# EAGLE design cambot (EAGLE 5.11)
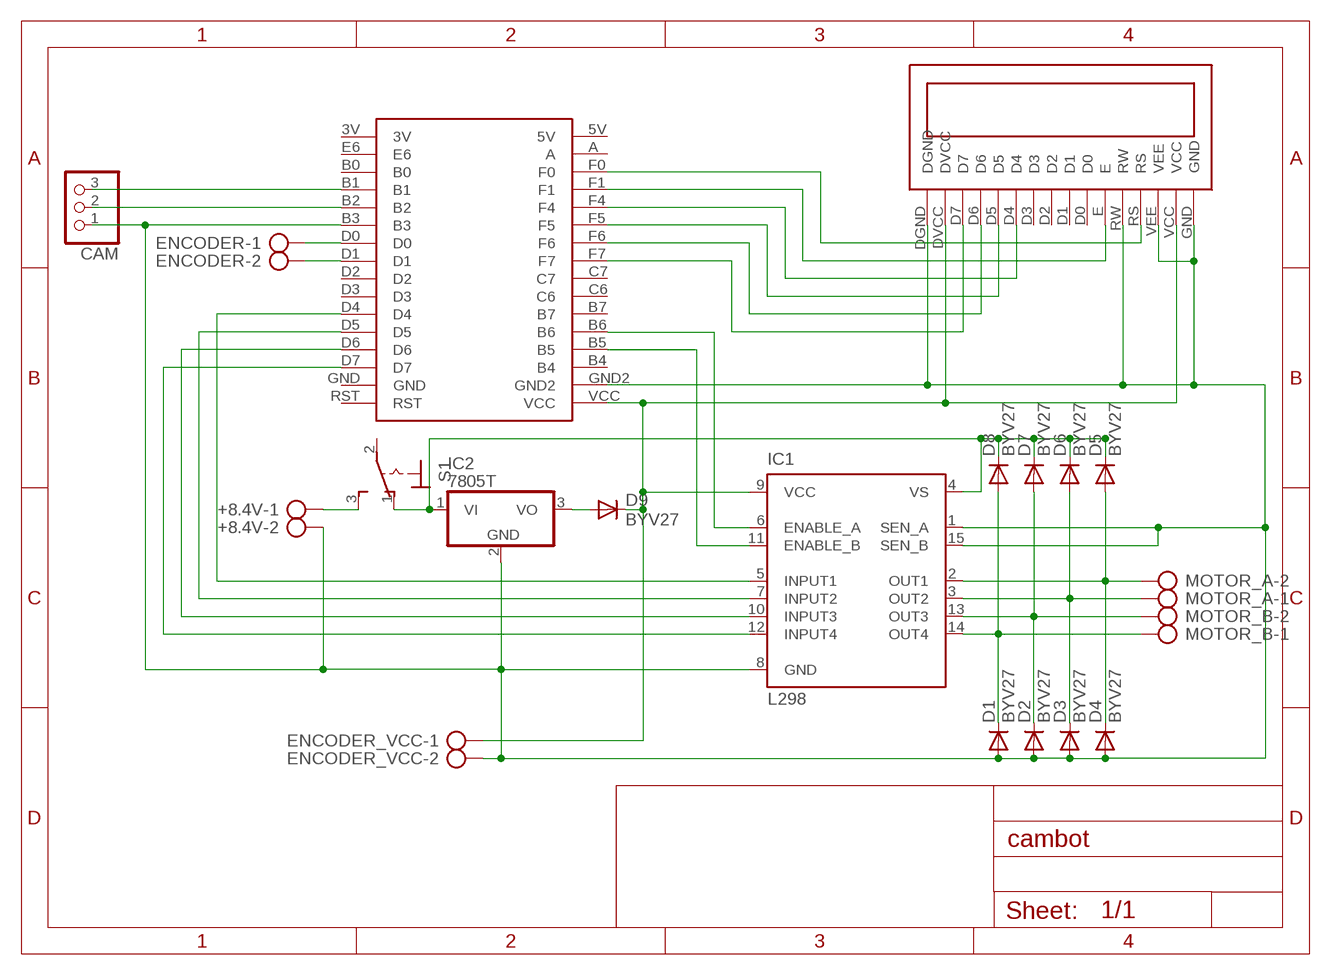
[diagram p0: schematic, sheet 1]

## Parts
+8.4V  AK500/2  [AK500/2]
CAM  PINHD-1X3  [1X03]
D1  BYV27  [SOD57-10]
D2  BYV27  [SOD57-10]
D3  BYV27  [SOD57-10]
D4  BYV27  [SOD57-10]
D5  BYV27  [SOD57-10]
D6  BYV27  [SOD57-10]
D7  BYV27  [SOD57-10]
D8  BYV27  [SOD57-10]
D9  BYV27  [SOD57-10]
ENCODER  AK500/2  [AK500/2]
ENCODER_VCC  AK500/2  [AK500/2]
IC1  L298  [MULTIWATT-15]
IC2  7805T  [TO220H]
MOTOR_A  AK500/2  [AK500/2]
MOTOR_B  AK500/2  [AK500/2]
S1  320-916  [320-916]
U$1  ATMEGA32U4BREAKOUTBOARD  [ATMEGA32U4BREAKOUT]
U$2  LCD16X2  [LCD2X16]

## Nets
N$1: D9.C ENCODER_VCC.1 IC1.9(VCC) U$1.VCC U$2.DVCC U$2.VCC
N$2: D5.C D6.C D7.C D8.C IC1.4(VS) IC2.1(VI) S1.1(O)
N$3: U$1.F0 U$2.RS
N$4: D4.C D5.A IC1.2(OUT1) MOTOR_A.2
N$5: D3.C D6.A IC1.3(OUT2) MOTOR_A.1
N$6: D2.C D7.A IC1.13(OUT3) MOTOR_B.2
N$7: D1.C D8.A IC1.14(OUT4) MOTOR_B.1
N$8: IC1.6(ENABLE_A) U$1.B6
N$9: IC1.11(ENABLE_B) U$1.B5
N$10: IC1.5(INPUT1) U$1.D4
N$11: IC1.7(INPUT2) U$1.D5
N$12: IC1.10(INPUT3) U$1.D6
N$13: IC1.12(INPUT4) U$1.D7
N$14: CAM.3 U$1.B1
N$15: CAM.2 U$1.B2
N$16: U$1.F1 U$2.E
N$17: ENCODER.1 U$1.D0
N$18: ENCODER.2 U$1.D1
N$19: +8.4V.2 CAM.1 D1.A D2.A D3.A D4.A ENCODER_VCC.2 IC1.1(SEN_A) IC1.8(GND) IC1.15(SEN_B) IC2.2(GND) U$1.B3 U$1.GND2 U$2.DGND U$2.GND U$2.RW U$2.VEE
N$20: U$1.F4 U$2.D4
N$21: U$1.F5 U$2.D5
N$22: U$1.F6 U$2.D6
N$23: U$1.F7 U$2.D7
N$24: D9.A IC2.3(VO)
N$25: +8.4V.1 S1.3(S)
Unconnected: S1.2(P) U$1.3V U$1.5V U$1.A U$1.B0 U$1.B4 U$1.B7 U$1.C6 U$1.C7 U$1.D2 U$1.D3 U$1.E6 U$1.GND U$1.RST U$2.D0 U$2.D1 U$2.D2 U$2.D3

## Library data of the parts
+8.4V ENCODER ENCODER_VCC MOTOR_A MOTOR_B = con-ptr500:AK500/2: CONNECTOR; OC_FARNELL: unknown; OC_NEWARK: unknown
CAM = pinhead:PINHD-1X3: PIN HEADER
D1-D9 = diode:BYV27: DIODE ultra fast
IC1 = st-microelectronics:L298: DUAL FULL-BRIDGE DRIVER; MPN: L298N; OC_FARNELL: 1589425; OC_NEWARK: 32M1527
IC2 = linear:78*: Positive VOLTAGE REGULATOR Source: http://cache.national.com/ds/LM/LM78L05.pdf http://www.fairchildsemi.com/ds/LM/LM7805.pdf
S1 = switch:320-916: TOGGLE SWITCH distributor RS Components
U$1 = atmega32u4breakout:ATMEGA32U4BREAKOUTBOARD
U$2 = lcd16x2:LCD16X2

## Board
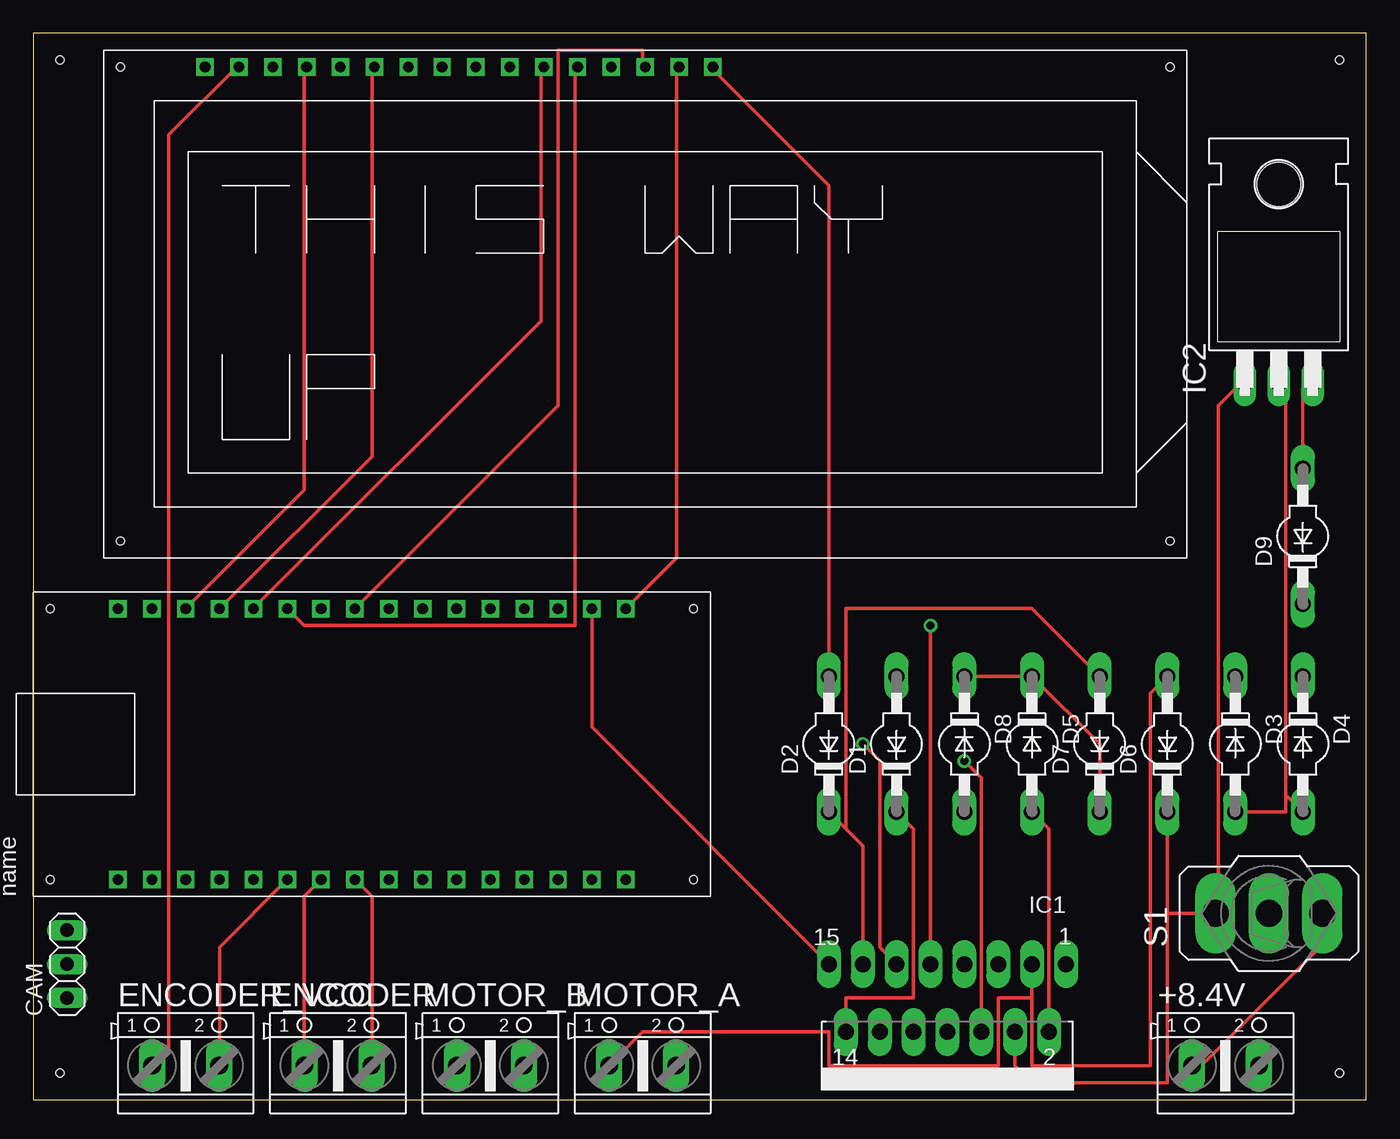
[diagram p1: board, top side]
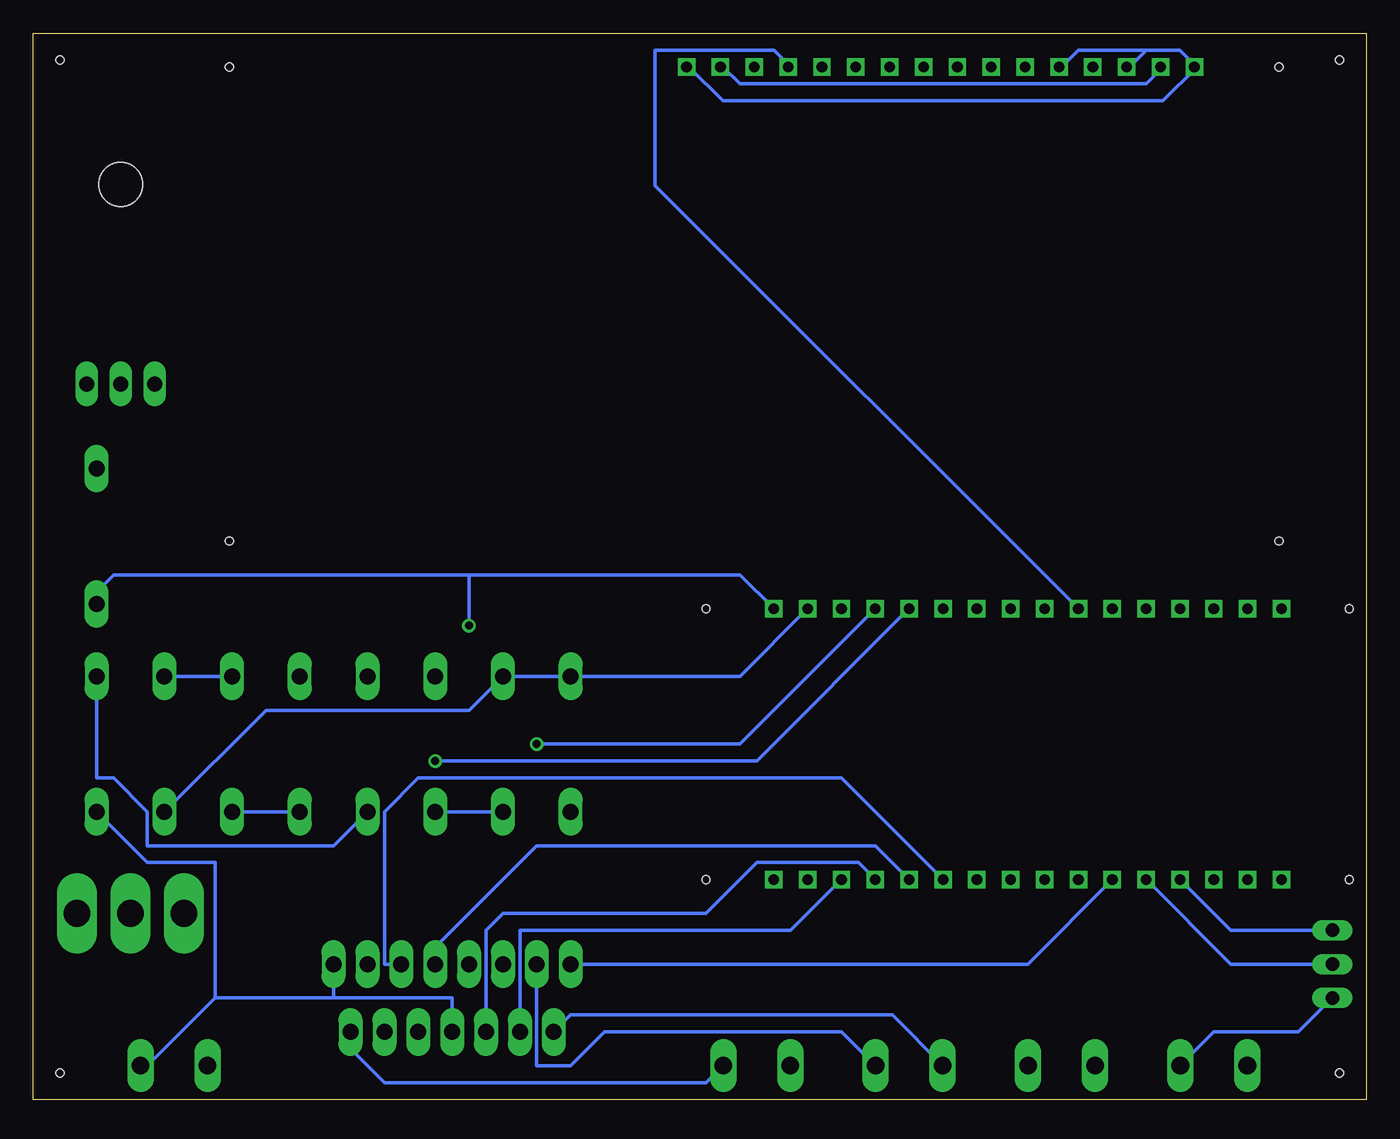
[diagram p2: board, bottom side, seen from below]

Size 100 x 80 mm. Coordinates in mm from the lower left corner, seen from the top.
Outline: 0,0 100,0 100,80 0,80 0,0
Copper layers (1*16): Top 0.035mm / dielectric 1.5mm / Bottom 0.035mm
Design rules "default": minimum track width 10mil, minimum drill 24mil, track to track 8mil, track to pad 8mil, pad to pad 8mil, via to via 8mil, smd to smd 8mil, copper to edge 40mil, drill to drill 8mil, minimum pad ring 10mil, minimum via ring 8mil, stop-mask expansion 4mil, vias tented up to drill 0mil, thermal gap 10mil
Holes 0.6 mm at 2,78 98,78 98,2 2,2

### Footprints (pad centres in the part's own frame; a part is rotated, then mirrored left to right if it is on the bottom)
AK500/2 = drill 1.321 long: 1 -2.515,0; 2 2.515,0
1X03 = drill 1.016 long: 1 -2.54,0; 2 0,0; 3 2.54,0
SOD57-10 = drill 1.194 long: A 5.08,0; C -5.08,0
MULTIWATT-15 = drill 1.2 long: 1 -8.89,-7.62; 2 -7.62,-2.54; 3 -6.35,-7.62; 4 -5.08,-2.54; 5 -3.81,-7.62; 6 -2.54,-2.54; 7 -1.27,-7.62; 8 0,-2.54; 9 1.27,-7.62; 10 2.54,-2.54; 11 3.81,-7.62; 12 5.08,-2.54; 13 6.35,-7.62; 14 7.62,-2.54; 15 8.89,-7.62
TO220H = drill 1.118 long: 1 -2.54,-10.16; 2 0,-10.16; 3 2.54,-10.16 | hole 3.302: 0,4.826
320-916 = drill 2.007 long: 1 0,4.013; 2 0,0; 3 0,-4.013
ATMEGA32U4BREAKOUT = drill 0.8 square: 3V -10.16,19.05; 5V 10.16,19.05; A 10.16,16.51; B0 -10.16,13.97; B1 -10.16,11.43; B2 -10.16,8.89; B3 -10.16,6.35; B4 10.16,-13.97; B5 10.16,-11.43; B6 10.16,-8.89; B7 10.16,-6.35; C6 10.16,-3.81; C7 10.16,-1.27; D0 -10.16,3.81; D1 -10.16,1.27; D2 -10.16,-1.27; D3 -10.16,-3.81; D4 -10.16,-6.35; D5 -10.16,-8.89; D6 -10.16,-11.43; D7 -10.16,-13.97; E6 -10.16,16.51; F0 10.16,13.97; F1 10.16,11.43; F4 10.16,8.89; F5 10.16,6.35; F6 10.16,3.81; F7 10.16,1.27; GND -10.16,-16.51; GND2 10.16,-16.51; RST -10.16,-19.05; VCC 10.16,-19.05 | hole 0.6: -10.16,24.13; 10.16,24.13; -10.16,-24.13; 10.16,-24.13
LCD2X16 = drill 0.8 square: D0 -17.78,17.78; D1 -15.24,17.78; D2 -12.7,17.78; D3 -10.16,17.78; D4 -7.62,17.78; D5 -5.08,17.78; D6 -2.54,17.78; D7 0,17.78; DGND 5.08,17.78; DVCC 2.54,17.78; E -20.32,17.78; GND -33.02,17.78; RS -25.4,17.78; RW -22.86,17.78; VCC -30.48,17.78; VEE -27.94,17.78 | hole 0.6: -39.37,17.78; 39.37,17.78; 39.37,-17.78; -39.37,-17.78

### Placement (x,y rotation side)
+8.4V  89.44,2.54 0 top
CAM  2.54,10.16 90 top
D1  64.77,26.67 90 top
D2  59.69,26.67 90 top
D3  90.17,26.67 270 top
D4  95.25,26.67 270 top
D5  74.93,26.67 270 top
D6  85.09,26.67 90 top
D7  80.01,26.67 90 top
D8  69.85,26.67 270 top
D9  95.25,42.26 90 top
ENCODER  22.86,2.54 0 top
ENCODER_VCC  11.43,2.54 0 top
IC1  68.58,2.54 180 top
IC2  93.44,63.85 0 top
MOTOR_A  45.72,2.54 0 top
MOTOR_B  34.29,2.54 0 top
S1  92.71,13.97 90 top
U$1  25.4,26.67 90 top
U$2  45.91,59.69 0 top

### Tracks (layer width: path | path; a pad name or v marks a point on that pad's centre or on a via)
N$1  (via drill 0.61)
  Top 0.254: U$1.VCC 48.26,40.64 48.26,77.47 U$2.DVCC | v67.31,35.56 IC1.9 | ENCODER_VCC.1 8.89,2.54 10.16,3.81 10.16,72.39 15.24,77.47 U$2.VCC
  Bottom 0.254: U$2.VCC 15.24,77.47 16.51,76.2 46.99,76.2 48.26,77.47 U$2.DVCC | 67.31,39.37 46.99,39.37 U$1.VCC | 67.31,39.37 93.98,39.37 95.25,38.1 D9.C | 67.31,39.37 v67.31,35.56
N$2
  Top 0.254: D8.C D5.C 80.01,26.67 D7.C | IC1.4 73.66,2.54 74.93,1.27 85.09,1.27 85.09,13.97 | 85.09,13.97 D6.C | IC2.1 90.17,53.34 88.9,52.07 88.9,13.97 S1.1 85.09,13.97
  Bottom 0.254: D6.C D7.C
N$3
  Top 0.254: U$1.F0 20.32,45.72 20.32,77.47 U$2.RS
N$4
  Top 0.254: D5.A 76.2,20.32 IC1.2
  Bottom 0.254: D4.C 95.25,24.13 93.98,24.13 91.44,21.59 91.44,19.05 77.47,19.05 D5.A | IC1.2 76.2,3.81 73.66,1.27 49.53,1.27 48.26,2.54 MOTOR_A.2
N$5
  Top 0.254: 74.93,7.62 74.93,2.54 83.82,2.54 83.82,30.48 D6.A | 74.93,7.62 IC1.3 | 74.93,7.62 72.39,7.62 72.39,2.54 59.69,2.54 59.69,5.08 45.72,5.08 43.18,2.54 MOTOR_A.1
  Bottom 0.254: D6.A D3.C
N$6
  Top 0.254: 60.96,20.32 62.23,19.05 IC1.13 | 60.96,20.32 D2.C | D7.A 74.93,36.83 60.96,36.83 60.96,20.32
  Bottom 0.254: IC1.13 62.23,2.54 59.69,2.54 57.15,5.08 39.37,5.08 36.83,2.54 MOTOR_B.2
N$7
  Top 0.254: D1.C 66.04,20.32 66.04,7.62 60.96,7.62 IC1.14
  Bottom 0.254: D1.C D8.A | IC1.14 59.69,6.35 35.56,6.35 31.75,2.54 MOTOR_B.1
N$8  (via drill 0.61)
  Top 0.254: v69.85,25.4 71.12,24.13 IC1.6
  Bottom 0.254: U$1.B6 45.72,25.4 v69.85,25.4
N$9  (via drill 0.61)
  Top 0.254: v62.23,26.67 63.5,25.4 63.5,11.43 IC1.11
  Bottom 0.254: U$1.B5 46.99,26.67 v62.23,26.67
N$10
  Bottom 0.254: U$1.D4 39.37,24.13 71.12,24.13 73.66,21.59 73.66,10.16 IC1.5
N$11
  Bottom 0.254: U$1.D5 36.83,19.05 62.23,19.05 69.85,11.43 IC1.7
N$12
  Bottom 0.254: U$1.D6 38.1,17.78 45.72,17.78 49.53,13.97 64.77,13.97 66.04,12.7 IC1.10
N$13
  Bottom 0.254: U$1.D7 43.18,12.7 63.5,12.7 IC1.12
N$14
  Bottom 0.254: U$1.B1 10.16,12.7 CAM.3
N$15
  Bottom 0.254: U$1.B2 10.16,10.16 CAM.2
N$16
  Top 0.254: U$1.F1 25.4,48.26 25.4,77.47 U$2.E
N$17
  Top 0.254: U$1.D0 20.32,15.24 20.32,2.54 ENCODER.1
N$18
  Top 0.254: U$1.D1 25.4,15.24 25.4,2.54 ENCODER.2
N$19
  Top 0.254: 93.98,22.86 93.98,53.34 IC2.2 | 93.98,22.86 D4.A | D3.A 93.98,21.59 93.98,22.86 | U$1.B3 13.97,11.43 13.97,2.54 ENCODER_VCC.2 | D2.A 59.69,68.58 50.8,77.47 U$2.DGND | IC1.15 41.91,27.94 U$1.GND2
  Bottom 0.254: IC1.8 68.58,7.62 77.47,7.62 | 86.36,7.62 77.47,7.62 | 86.36,7.62 91.44,2.54 +8.4V.2 | 77.47,7.62 IC1.1 | 86.36,7.62 86.36,17.78 91.44,17.78 D4.A | CAM.1 5.08,5.08 11.43,5.08 13.97,2.54 ENCODER_VCC.2 | 12.7,77.47 13.97,78.74 16.51,78.74 | 16.51,78.74 17.78,77.47 U$2.VEE | 16.51,78.74 21.59,78.74 22.86,77.47 U$2.RW | U$1.GND2 46.99,31.75 D2.A D1.A 67.31,29.21 82.55,29.21 D3.A | 12.7,77.47 15.24,74.93 48.26,74.93 50.8,77.47 U$2.DGND | 12.7,77.47 U$2.GND | U$1.B3 25.4,10.16 IC1.15
N$20
  Top 0.254: U$1.F4 38.1,58.42 38.1,77.47 U$2.D4
N$21
  Top 0.254: U$1.F5 20.32,35.56 40.64,35.56 40.64,77.47 U$2.D5
N$22
  Bottom 0.254: U$1.F6 53.34,68.58 53.34,78.74 44.45,78.74 43.18,77.47 U$2.D6
N$23
  Top 0.254: U$1.F7 39.37,52.07 39.37,78.74 45.72,78.74 45.72,77.47 U$2.D7
N$24
  Top 0.254: IC2.3 95.25,53.34 D9.A
N$25
  Top 0.254: +8.4V.1 87.63,2.54 96.52,11.43 96.52,13.97 S1.3